# EAGLE design SLIM-IFA-33-R0 (EAGLE 5.11)
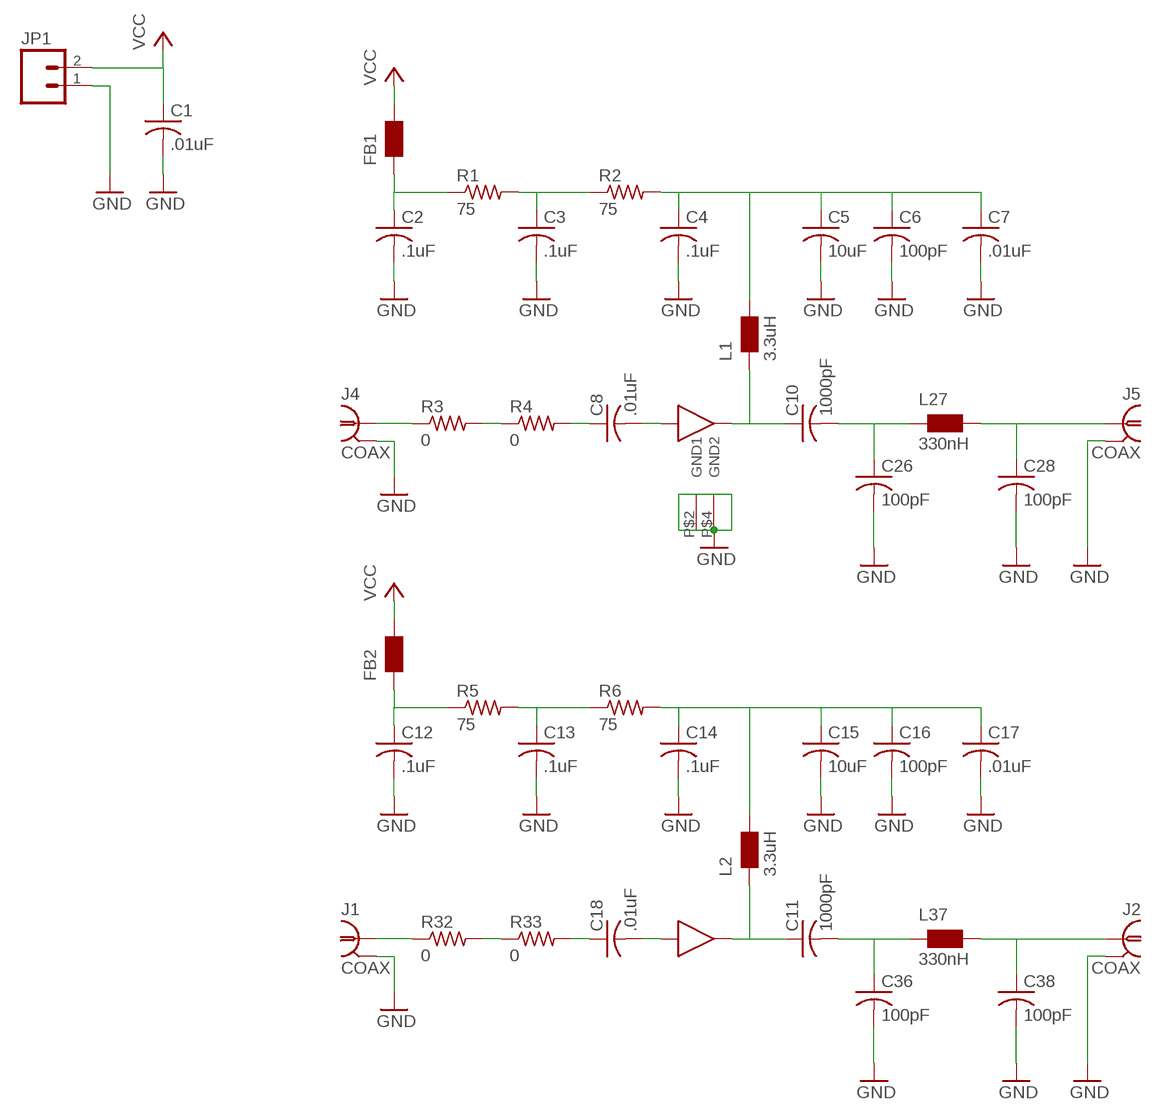
[diagram p0: schematic, sheet 1]

## Parts
C1  .01uF  C-USC0805  [C0805]
C2  .1uF  C-USC0805  [C0805]
C3  .1uF  C-USC0805  [C0805]
C4  .1uF  C-USC0805  [C0805]
C5  10uF  C-USC0805  [C0805]
C6  100pF  C-USC0805  [C0805]
C7  .01uF  C-USC0805  [C0805]
C8  .01uF  C-USC0805  [C0805]
C10  1000pF  C-USC0805  [C0805]
C11  1000pF  C-USC0805  [C0805]
C12  .1uF  C-USC0805  [C0805]
C13  .1uF  C-USC0805  [C0805]
C14  .1uF  C-USC0805  [C0805]
C15  10uF  C-USC0805  [C0805]
C16  100pF  C-USC0805  [C0805]
C17  .01uF  C-USC0805  [C0805]
C18  .01uF  C-USC0805  [C0805]
C26  100pF  C-USC0805  [C0805]
C28  100pF  C-USC0805  [C0805]
C36  100pF  C-USC0805  [C0805]
C38  100pF  C-USC0805  [C0805]
FB1  WE-CBF_0805  [0805]
FB2  WE-CBF_0805  [0805]
J1  COAX  [SLIM_COAX_PAD]
J2  COAX  [SLIM_COAX_PAD]
J4  COAX  [SLIM_COAX_PAD]
J5  COAX  [SLIM_COAX_PAD]
JP1  M02POLAR  [MOLEX-1X2]
L1  3.3uH  WE-CBF_0805  [0805]
L2  3.3uH  WE-CBF_0805  [0805]
L27  330nH  WE-CBF_0805  [0805]
L37  330nH  WE-CBF_0805  [0805]
R1  75  R-US_R0805  [R0805]
R2  75  R-US_R0805  [R0805]
R3  0  R-US_R0805  [R0805]
R4  0  R-US_R0805  [R0805]
R5  75  R-US_R0805  [R0805]
R6  75  R-US_R0805  [R0805]
R32  0  R-US_R0805  [R0805]
R33  0  R-US_R0805  [R0805]
U1  ERA-33  [WW107]
U2  ERA-33  [WW107]

## Nets
GND: C1.2 C2.2 C3.2 C4.2 C5.2 C6.2 C7.2 C12.2 C13.2 C14.2 C15.2 C16.2 C17.2 C26.2 C28.2 C36.2 C38.2 J1.P$2(GND) J2.P$2(GND) J4.P$2(GND) J5.P$2(GND) JP1.1 U1.P$2(GND1) U1.P$4(GND2)
N$1: C2.1 FB1.1 R1.1
N$2: C3.1 R1.2 R2.1
N$3: C4.1 C5.1 C6.1 C7.1 L1.2 R2.2
N$4: J4.P$1 R3.1
N$5: R3.2 R4.1
N$6: C8.1 R4.2
N$7: C10.1 L1.1 U1.P$3(RF_OUT)
N$8: C10.2 C26.1 L27.1
N$9: C28.1 J5.P$1 L27.2
N$10: C8.2 U1.P$1(RF_IN)
N$11: C12.1 FB2.1 R5.1
N$12: C13.1 R5.2 R6.1
N$13: C14.1 C15.1 C16.1 C17.1 L2.2 R6.2
N$14: J1.P$1 R32.1
N$15: R32.2 R33.1
N$16: C18.1 R33.2
N$17: C11.1 L2.1 U2.P$3(RF_OUT)
N$18: C11.2 C36.1 L37.1
N$19: C38.1 J2.P$1 L37.2
N$20: C18.2 U2.P$1(RF_IN)
VCC: C1.1 FB1.2 FB2.2 JP1.2

## Power pins joined to a net without a drawn wire
GND1: U2.P$2(GND1)
GND2: U2.P$4(GND2)

## Library data of the parts
C1-C8 C10-C18 C26 C28 C36 C38 = rcl:C-US: CAPACITOR, American symbol
FB1 FB2 L1 L2 L27 L37 = wuerth-elektronik:WE-CBF: SMD EMI Suppression Ferrite Beads - excellent anti-EMI properties - low DCR - impedances till 3000 ohms - rated current up to 6 A
J1 J2 J4 J5 = SLIM:COAX
JP1 = SparkFun:M02: Header 2 Standard 2-pin 0.1" header. Use with straight break away headers (SKU : PRT-00116), right angle break away headers (PRT-00553), swiss pins (PRT-00743), machine pins (PRT-00117), and female headers (PRT-00115). Molex polarized connector foot print use with SKU : PRT-08233 with associated crimp pins and housings.
R1-R6 R32 R33 = rcl:R-US_: RESISTOR, American symbol
U1 U2 = Minicircuits:ERA-33

## Board
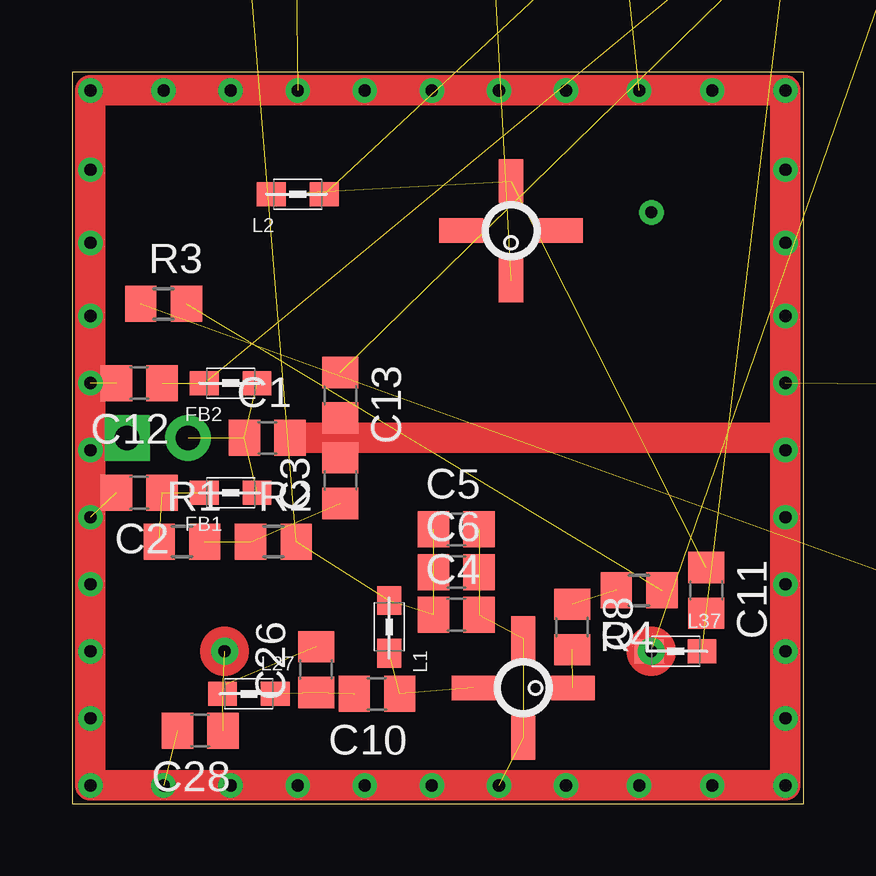
[diagram p1: board, top side]
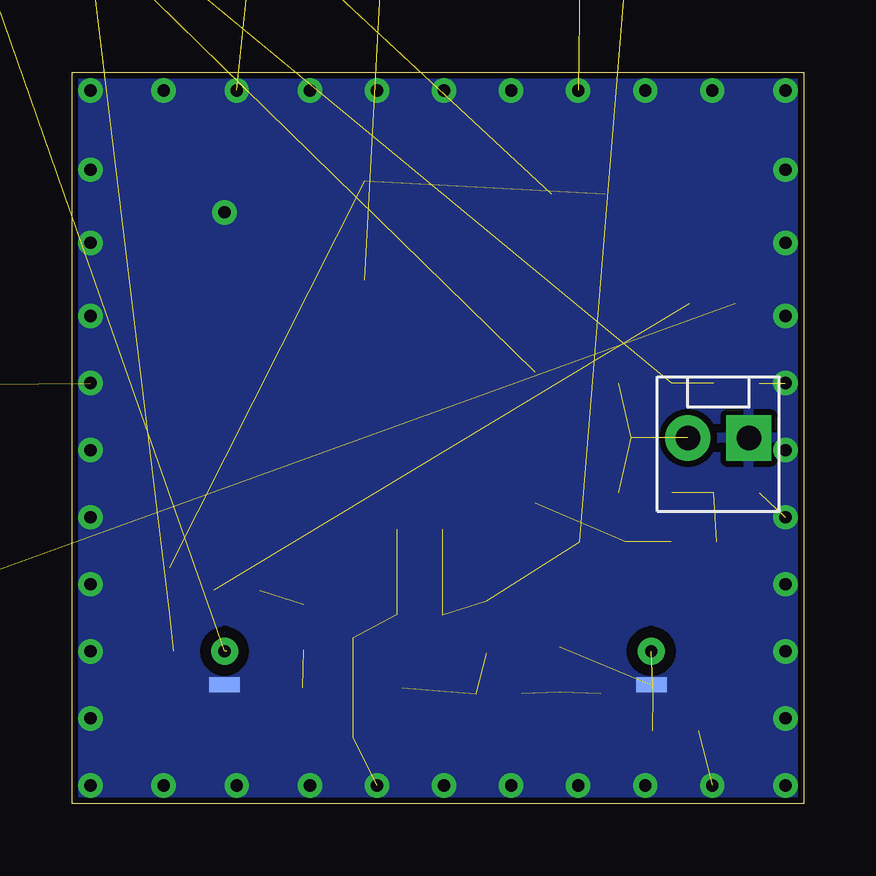
[diagram p2: board, bottom side, seen from below]

Size 30.48 x 30.48 mm. Coordinates in mm from the lower left corner, seen from the top.
Outline: 0,0 30.48,0 30.48,30.48 0,30.48 0,0
Copper layers (1*16): Top 0.035mm / dielectric 1.5mm / Bottom 0.035mm
Design rules: minimum track width 8mil, minimum drill 20mil, track to track 8mil, track to pad 8mil, pad to pad 8mil, via to via 8mil, smd to smd 8mil, copper to edge 10mil, drill to drill 8mil, minimum pad ring 12mil, minimum via ring 10mil, stop-mask expansion 4mil, vias tented up to drill 25mil, thermal gap 10mil

### Footprints (pad centres in the part's own frame; a part is rotated, then mirrored left to right if it is on the bottom)
C0805 = smd 1.3 x 1.5: 1 -0.95,0; 2 0.95,0
0805 = smd 1.2 x 1: 1 -1.1,0; 2 1.1,0
SLIM_COAX_PAD = drill 0.508 pad 1.016: P$1 0,0 | smd 1.27 x 0.635 bottom: P$2 0,-1.397
MOLEX-1X2 = drill 1.016 pad 1.88 square: 1 0,0 | drill 1.016 pad 1.88: 2 2.54,0
R0805 = smd 1.3 x 1.5: 1 -0.95,0; 2 0.95,0
WW107 = smd 1.016 x 1.829: P$1 0,-2.07; P$3 0,2.07 | smd 1.829 x 1.016: P$2 2.07,0; P$4 -2.07,0

### Placement (x,y rotation side)
C1  8.13,15.24 0 top
C2  2.79,12.95 180 top
C3  11.18,13.46 90 top
C4  16,7.87 0 top
C5  16,11.43 0 top
C6  16,9.65 0 top
C7  8.38,34.29 0 top  (outside the outline)
C8  20.83,7.37 270 top
C10  12.7,4.57 180 top
C11  26.42,8.89 270 top
C12  2.79,17.53 180 top
C13  11.18,17.02 270 top
C14  22.1,35.31 0 top  (outside the outline)
C15  22.86,41.91 0 top  (outside the outline)
C16  24.64,48.51 0 top  (outside the outline)
C17  29.46,41.91 0 top  (outside the outline)
C18  16.26,41.91 0 top  (outside the outline)
C26  10.16,5.59 90 top
C28  5.33,3.05 180 top
C36  32.26,48.51 0 top  (outside the outline)
C38  39.88,48.51 0 top  (outside the outline)
FB1  6.6,12.95 0 top
FB2  6.6,17.53 0 top
J1  42.67,18.8 0 top  (outside the outline)
J2  24.13,6.35 0 top
J4  42.93,6.35 0 top  (outside the outline)
J5  6.35,6.35 0 top
JP1  2.29,15.24 180 bottom
L1  13.21,7.37 90 top
L2  9.4,25.4 0 top
L27  7.37,4.57 180 top
L37  25.15,6.35 180 top
R1  4.57,10.92 0 top
R2  8.38,10.92 0 top
R3  3.81,20.83 0 top
R4  23.62,8.89 180 top
R5  27.94,35.31 0 top  (outside the outline)
R6  33.02,35.31 0 top  (outside the outline)
R32  38.1,35.31 0 top  (outside the outline)
R33  43.18,35.31 0 top  (outside the outline)
U1  18.8,4.83 90 top
U2  18.29,23.88 0 top

### Tracks (layer width: path | path; a pad name or v marks a point on that pad's centre or on a via)
GND  (via drill 0.51)  (18 unrouted)
  Top 1.27: 29.72,15.24 v29.72,0.76 v0.76,0.76 v0.76,29.72 v29.72,29.72 29.72,15.24 | 29.72,15.24 11.18,15.24 | 11.18,15.24 C1.2 | 11.18,15.24 C13.2 | 11.18,15.24 C3.2
  other vias: 3.81,29.72 6.6,29.72 26.67,29.72 12.19,29.72 9.4,29.72 14.99,29.72 17.78,29.72 23.62,29.72 0.76,3.56 0.76,6.35 0.76,26.42 0.76,11.94 0.76,9.14 0.76,14.73 0.76,17.53 0.76,20.32 0.76,23.37 29.72,3.56 29.72,26.42 29.72,11.94 29.72,14.73 29.72,20.32 29.72,23.37 3.81,0.76 6.6,0.76 26.67,0.76 12.19,0.76 9.4,0.76 14.99,0.76 17.78,0.76 20.57,0.76 23.62,0.76 20.57,29.72 24.13,24.64 29.72,17.53 29.72,9.14 29.72,6.35
  pour Bottom (isolate 0.254): 0,30.48 30.48,30.48 30.48,0 0,0
N$1  (2 unrouted)
N$2  (2 unrouted)
N$3  (5 unrouted)
N$4  (1 unrouted)
N$5  (1 unrouted)
N$6  (1 unrouted)
N$7  (2 unrouted)
N$8  (2 unrouted)
N$9  (2 unrouted)
N$10  (1 unrouted)
N$11  (2 unrouted)
N$12  (2 unrouted)
N$13  (5 unrouted)
N$14  (1 unrouted)
N$15  (1 unrouted)
N$16  (1 unrouted)
N$17  (2 unrouted)
N$18  (2 unrouted)
N$19  (2 unrouted)
N$20  (1 unrouted)
VCC  (3 unrouted)